# Altium schematic sheet ProbadorDeCables_Accesorios_B_RJ11.SchDoc
size A4
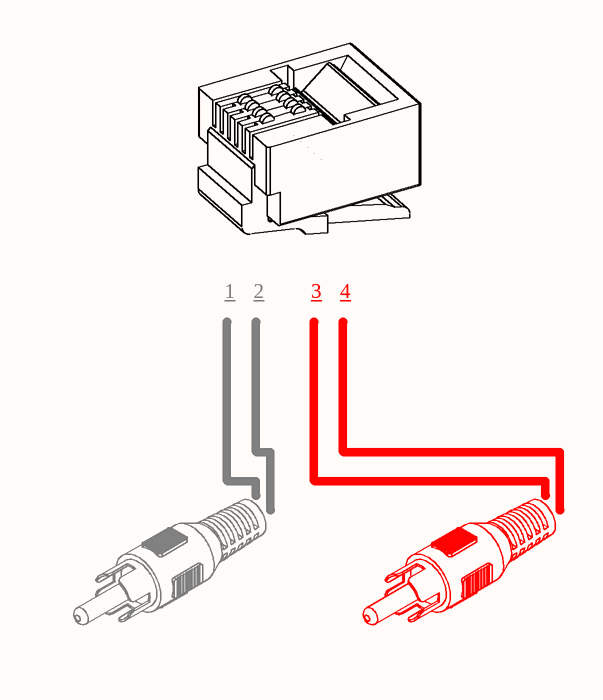
[diagram p0: ProbadorDeCables_Accesorios_B_RJ11.SchDoc]

## Parts
B_RJ11  RJ11 macho para cable  [BOM_RJ11-macho-para-cable]  (value not drawn)  (mechanical)
BOM_B_RJ11__1  RCP-023__Blanco  [BOM_RCP-023__Blanco]  (value not drawn)  (mechanical)
BOM_B_RJ11__2  RCP-022__Rojo  [BOM_RCP-022__Rojo]  (value not drawn)  (mechanical)

## Notes on the sheet
- 1
- 2
- 3
- 4

## Library data of the parts
B_RJ11 = RJ11 macho para cable: CONN MOD PLUG 6P4C UNSHIELDED; Cod.Fabricante: A-MO 6/4 SF; Fabricante: Assmann WSW Components; Cod.DigiKey: 123-A-MO6/4SF-ND; ComponentLink1Description: Manufacturer Link; ComponentLink1URL: http://www.assmann-wsw.com/fileadmin/datasheets/ASS_7278_CO.pdf; DIGIKEYx50: 0.18200; DIGIKEYx100: 0.16900
BOM_B_RJ11__1 = RCP-023__Blanco: CONN RCA PLUG MONO 2COND; Fabricante: CUI Devices; Cod.DigiKey: CP-1455-ND; Cod.Fabricante: RCP-023; ComponentLink1Description: Manufacturer Link; ComponentLink1URL: https://www.cuidevices.com/product/resource/digikeypdf/rcp-02x.pdf; DIGIKEYx50: 1.09940; DIGIKEYx100: 1.05160
BOM_B_RJ11__2 = RCP-022__Rojo: CONN RCA PLUG MONO 2COND; Fabricante: CUI Devices; Cod.DigiKey: CP-1454-ND; Cod.Fabricante: RCP-022; ComponentLink1Description: Manufacturer Link; ComponentLink1URL: https://www.cuidevices.com/product/resource/digikeypdf/rcp-02x.pdf; DIGIKEYx50: 1.09940; DIGIKEYx100: 1.05160